# Altium project MSM8916_DRAM_PMIC_REF.PrjPcb (part 4 of 4)

## Sheet SD Card_WCN_RF.SchDoc
size A0
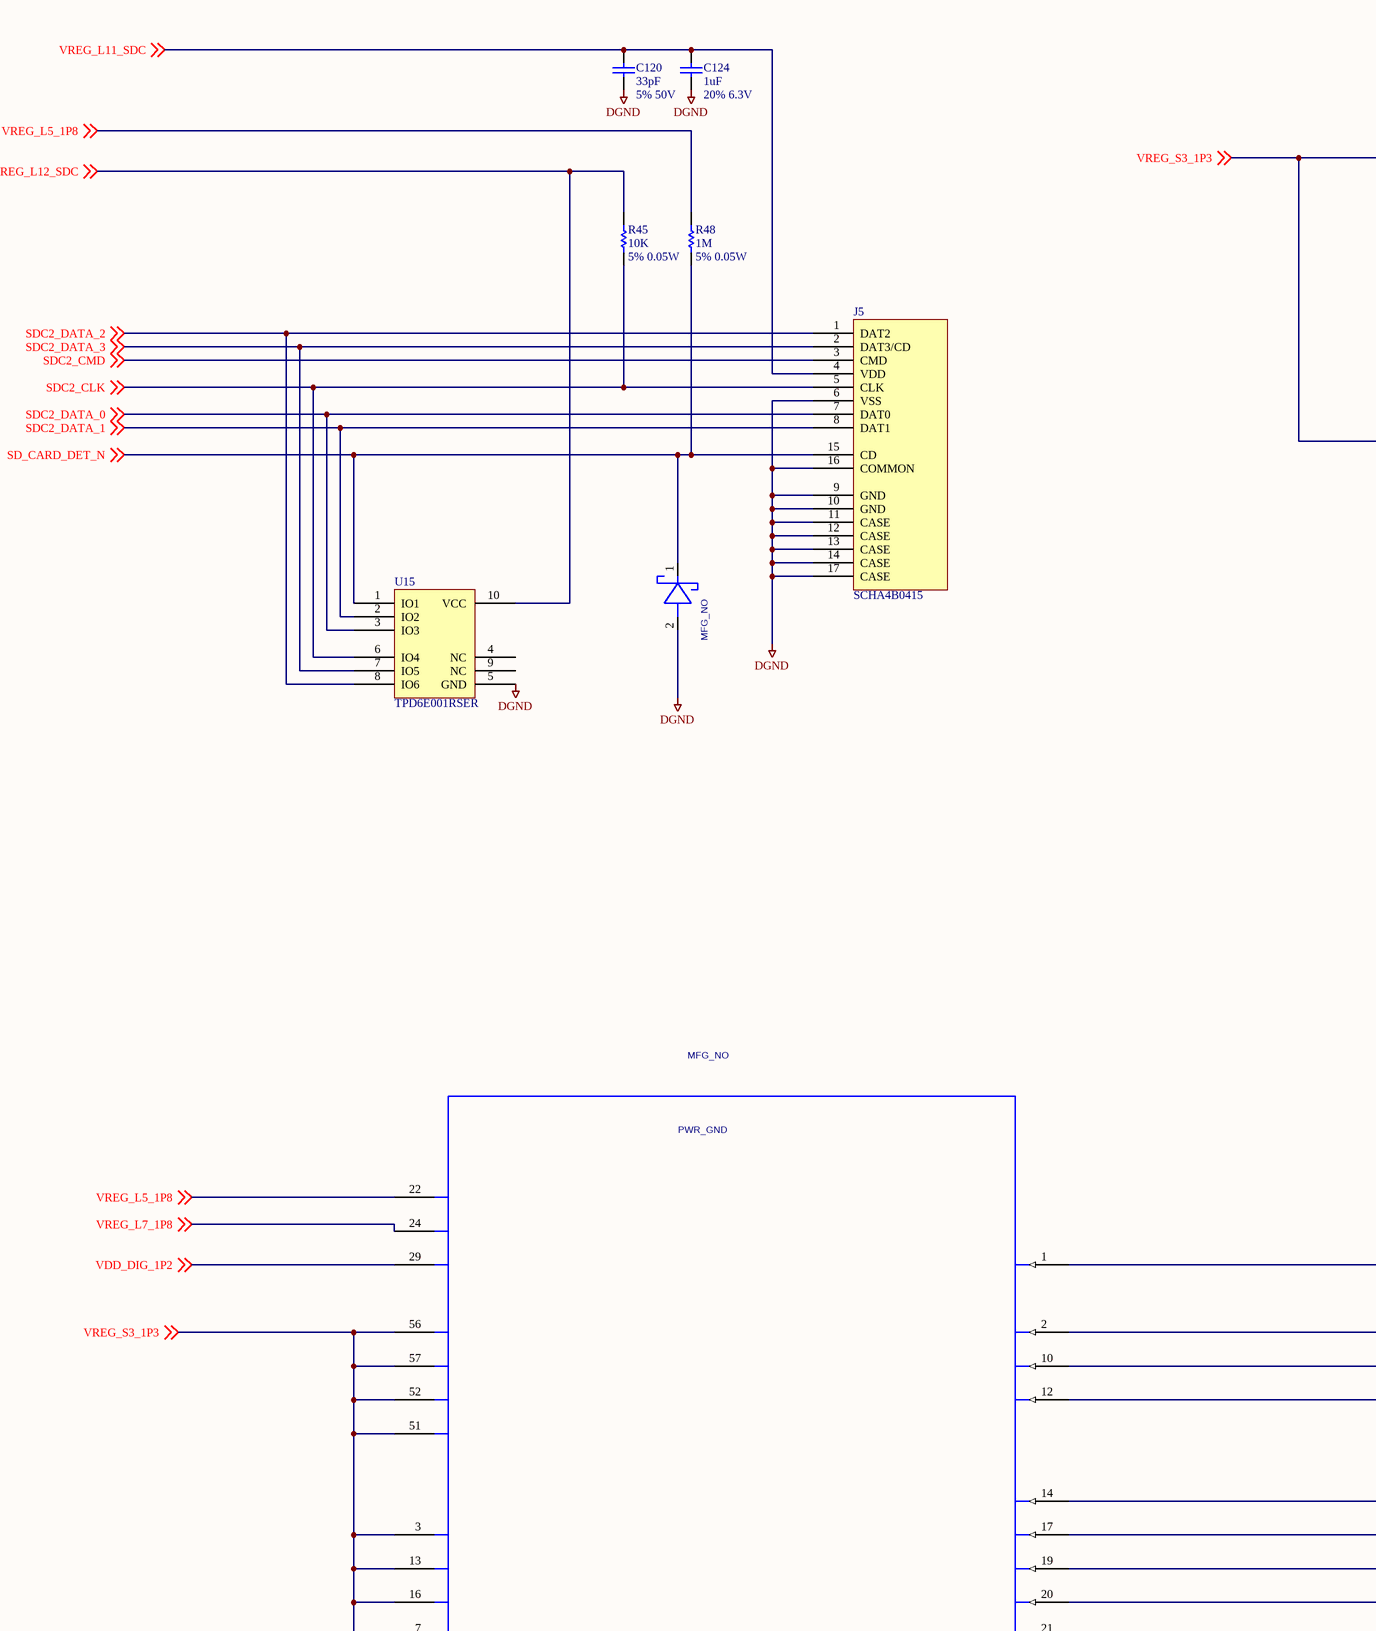
[diagram p60: SD Card_WCN_RF.SchDoc, top left]
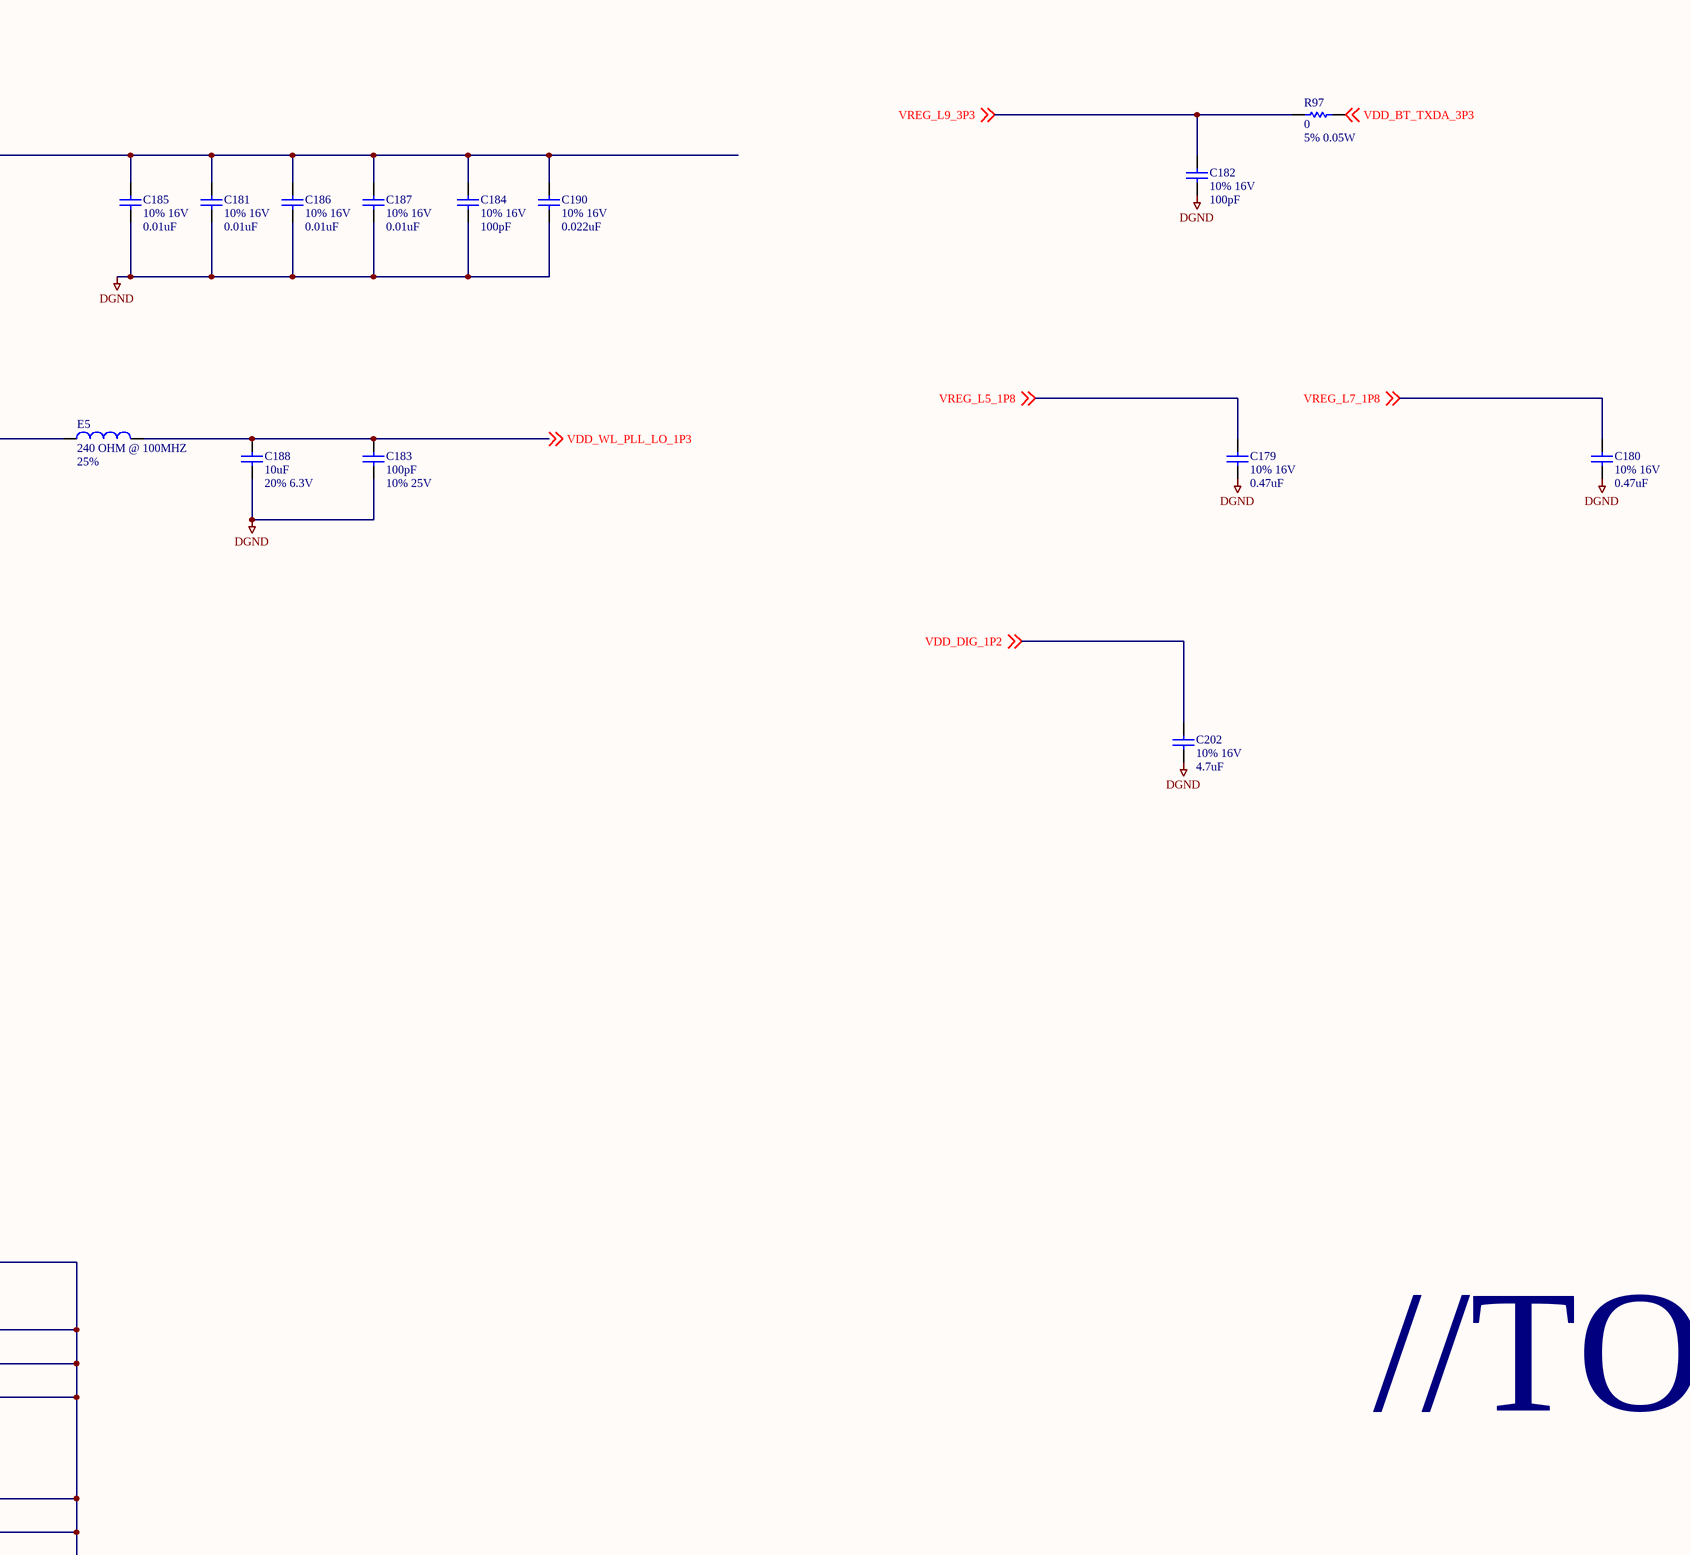
[diagram p61: SD Card_WCN_RF.SchDoc, top middle]
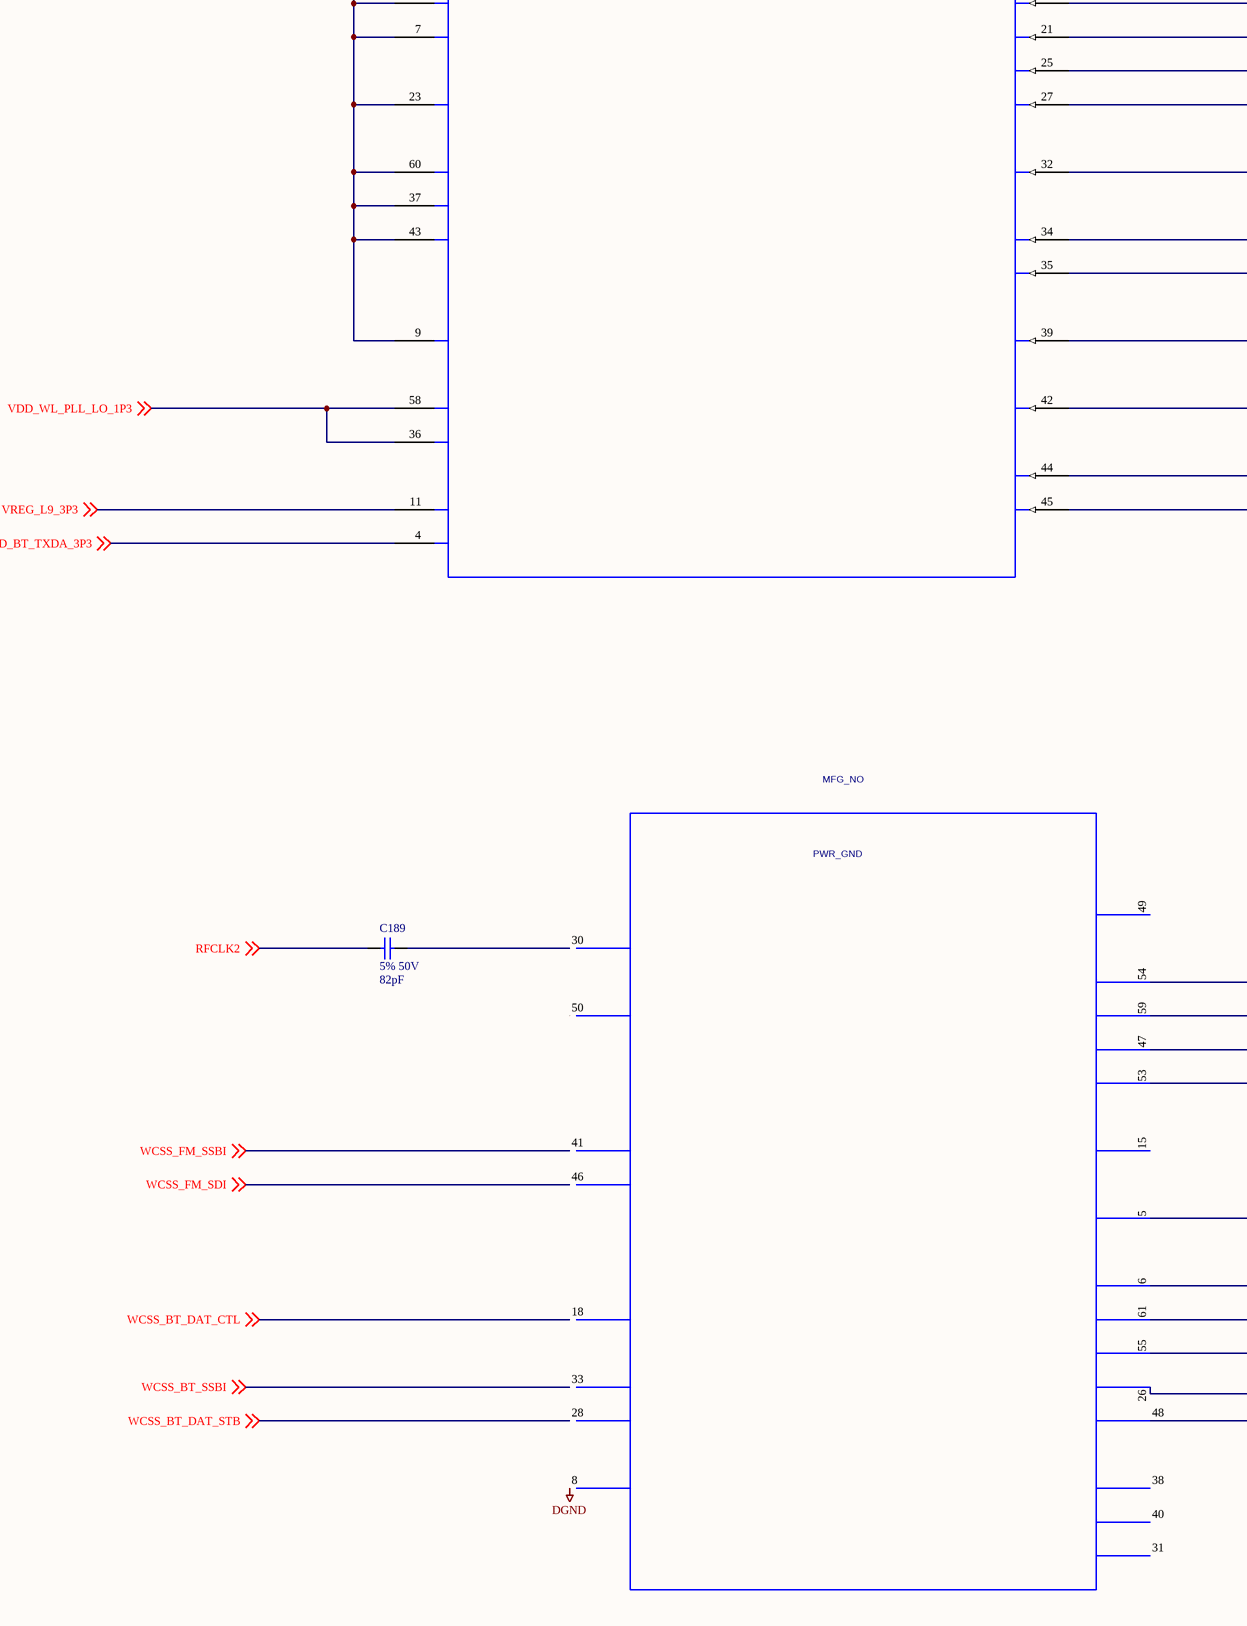
[diagram p62: SD Card_WCN_RF.SchDoc, bottom left]
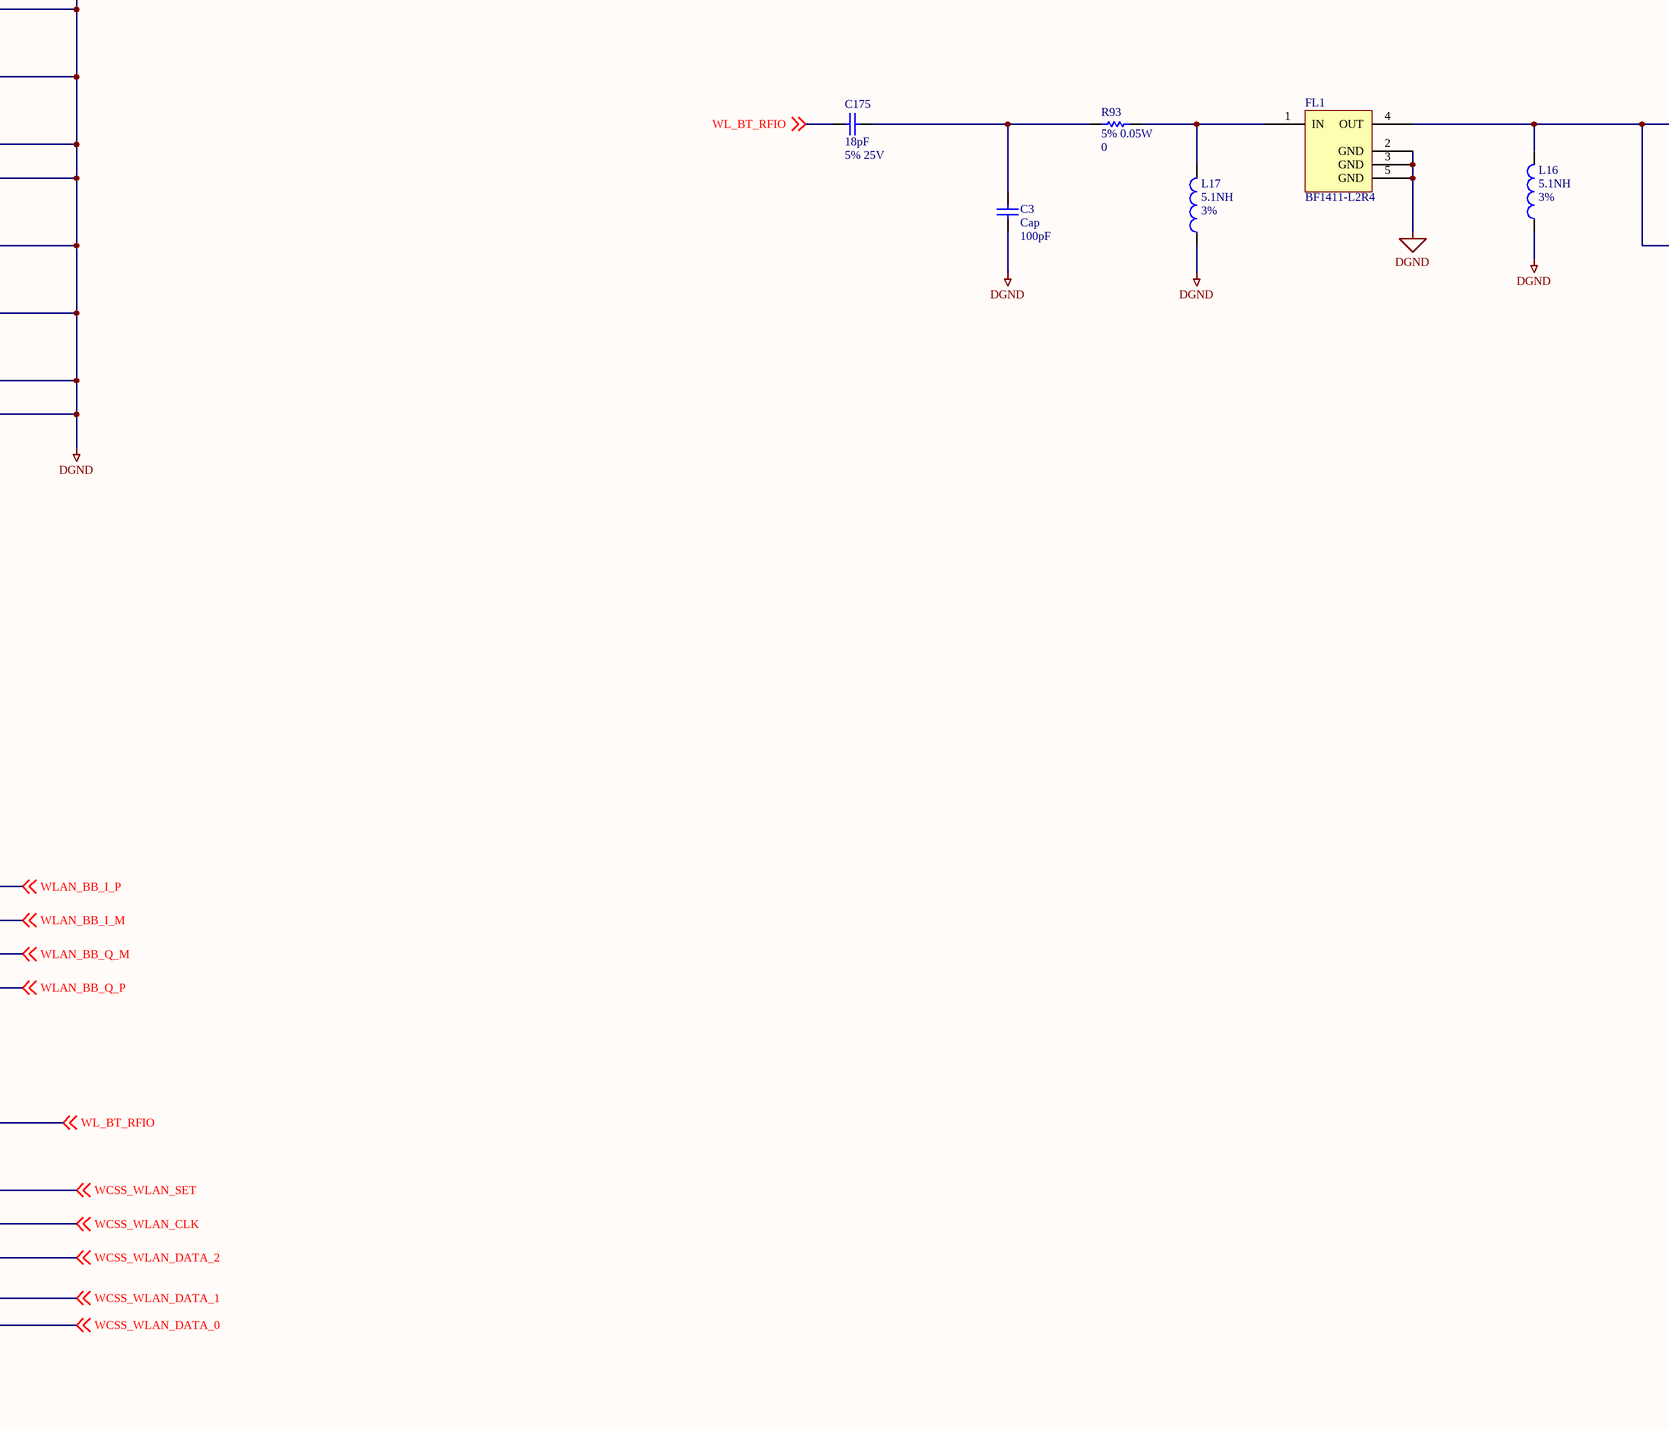
[diagram p63: SD Card_WCN_RF.SchDoc, bottom middle]
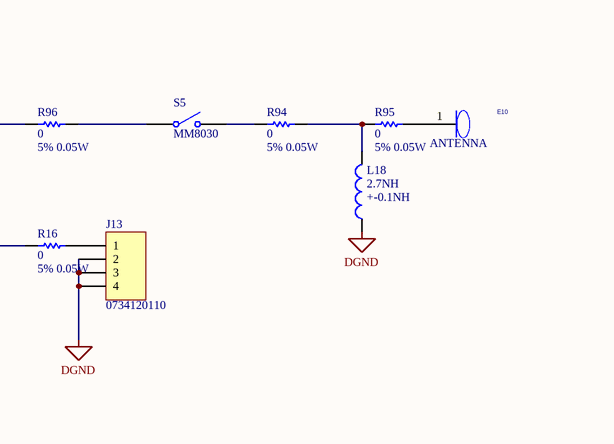
[diagram p64: SD Card_WCN_RF.SchDoc, bottom right]

### Parts
C3  Cap  value 100pF  [RAD-0.3]
C120  33pF  value 5% 50V  [C0402]
C124  1uF  value 20% 6.3V  [C0402]
C175  18pF  value 5% 25V  [RAD-0.3]
C179  10% 16V  value 0.47uF  [C0402]
C180  10% 16V  value 0.47uF  [C0402]
C181  10% 16V  value 0.01uF  [C0402]
C182  10% 16V  value 100pF  [C0402]
C183  100pF  value 10% 25V  [C0402]
C184  10% 16V  value 100pF  [C0402]
C185  10% 16V  value 0.01uF  [C0402]
C186  10% 16V  value 0.01uF  [C0402]
C187  10% 16V  value 0.01uF  [C0402]
C188  10uF  value 20% 6.3V  [C0402]
C189  5% 50V  value 82pF  [C0402]
C190  10% 16V  value 0.022uF  [C0402]
C202  10% 16V  value 4.7uF  [C0402]
CR24  PART_ID: MFG_NO  [c0402]  (hidden comment: ESD7C5)
E5  240 OHM @ 100MHZ  value 25%  [0402-A]
E10  ANTENNA  [TP]
FL1  BF1411-L2R4
J5  SCHA4B0415  [c0402]
J13  0734120110  [HDR1X4]
L16  5.1NH  value 3%  [0402-A]
L17  5.1NH  value 3%  [0402-A]
L18  2.7NH  value +-0.1NH  [0402-A]
R16  0  value 5% 0.05W  [AXIAL-0.3]
R45  10K  value 5% 0.05W  [r0402]
R48  1M  value 5% 0.05W  [r0402]
R93  5% 0.05W  value 0  [AXIAL-0.3]
R94  0  value 5% 0.05W  [AXIAL-0.3]
R95  0  value 5% 0.05W  [AXIAL-0.3]
R96  0  value 5% 0.05W  [AXIAL-0.3]
R97  0  value 5% 0.05W  [r0402]
S5  MM8030  [SPST-2]
U9  SYMNAME: PWR_GND  PART_ID: MFG_NO  [WCN-3620-0-61WLNSP-TR-05-0]  (hidden comment: ASIC_WCN3620_80_WL006_1)  (parts A,B of 2)
U15  TPD6E001RSER  [c0402]

### Nets
DGND: C3.1 C120.1 C124.1 C179.1 C180.1 C181.1 C182.1 C183.1 C184.1 C185.1 C186.1 C187.1 C188.1 C190.1 C202.1 CR24.2(POS) FL1.2(GND) FL1.3(GND) FL1.5(GND) J5.6(VSS) J5.9(GND) J5.10(GND) J5.11(CASE) J5.12(CASE) J5.13(CASE) J5.14(CASE) J5.16(COMMON) J5.17(CASE) J13.2 J13.3 J13.4 L16.1 L17.1 L18.1 U9.1(GND2) U9.2(GND3) U9.8(GND1) U9.10(GND4) U9.12(GND5) U9.14(GND6) U9.17(GND7) U9.19(GND8) U9.20(GND9) U9.21(GND10) U9.25(GND11) U9.27(GND12) U9.32(GND13) U9.34(GND14) U9.35(GND15) U9.39(GND16) U9.42(GND17) U9.44(GND18) U9.45(GND19) U15.5(GND)
VREG_L5_1P8: C179.2 R48.2 U9.22(VDD_IO_1P8) ; off-sheet VREG_L5_1P8
RFCLK2: C189.2 ; off-sheet RFCLK2
SD_CARD_DET_N: CR24.1(NEG) J5.15(CD) R48.1 U15.1(IO1) ; off-sheet SD_CARD_DET_N
SDC2_CLK: J5.5(CLK) R45.1 U15.6(IO4) ; off-sheet SDC2_CLK
SDC2_CMD: J5.3(CMD) ; off-sheet SDC2_CMD
SDC2_DATA_0: J5.7(DAT0) U15.3(IO3) ; off-sheet SDC2_DATA_0
SDC2_DATA_1: J5.8(DAT1) U15.2(IO2) ; off-sheet SDC2_DATA_1
SDC2_DATA_2: J5.1(DAT2) U15.8(IO6) ; off-sheet SDC2_DATA_2
SDC2_DATA_3: J5.2(DAT3/CD) U15.7(IO5) ; off-sheet SDC2_DATA_3
VDD_BT_TXDA_3P3: R97.2 U9.4(VDD_BT_DA_3P0) ; off-sheet VDD_BT_TXDA_3P3
VDD_DIG_1P2: C202.2 U9.29(VDD_DIG_1P2) ; off-sheet VDD_DIG_1P2
VDD_WL_PLL_LO_1P3: C183.2 C188.2 E5.2 U9.36(VDD_WL_LO_1P3) U9.58(VDD_WL_PLL_1P3) ; off-sheet VDD_WL_PLL_LO_1P3
VREG_L7_1P8: C180.2 U9.24(VDD_XO_1P8) ; off-sheet VREG_L7_1P8
VREG_L9_3P3: C182.2 R97.1 U9.11(VDD_WL_2GPA_3P0) ; off-sheet VREG_L9_3P3
VREG_L11_SDC: C120.2 C124.2 J5.4(VDD) ; off-sheet VREG_L11_SDC
VREG_L12_SDC: R45.2 U15.10(VCC) ; off-sheet VREG_L12_SDC
VREG_S3_1P3: C181.2 C184.2 C185.2 C186.2 C187.2 C190.2 E5.1 U9.3(VDD_BT_RF_1P3) U9.7(VDD_BT_VCO_1P3) U9.9(VDD_WL_2GLNA_1P3) U9.13(VDD_BT_BB_1P3) U9.16(VDD_BT_PLL_1P3) U9.23(VDD_BT_FM_DIG_1P3) U9.37(VDD_WL_2GPA_1P3) U9.43(VDD_WL_UPC_1P3) U9.51(VDD_FM_VCO_1P3) U9.52(VDD_FM_PLL_1P3) U9.56(VDD_FM_RXFE_1P3) U9.57(VDD_FM_RXBB_1P3) U9.60(VDD_WL_BB_1P3) ; off-sheet VREG_S3_1P3  [project net VREG_S3]
WCSS_BT_DAT_CTL: U9.18(BT_CTL) ; off-sheet WCSS_BT_DAT_CTL
WCSS_BT_DAT_STB: U9.28(BT_DATA) ; off-sheet WCSS_BT_DAT_STB
WCSS_BT_SSBI: U9.33(BT_SSBI) ; off-sheet WCSS_BT_SSBI
WCSS_FM_SDI: U9.46(FM_DATA) ; off-sheet WCSS_FM_SDI
WCSS_FM_SSBI: U9.41(FM_SSBI) ; off-sheet WCSS_FM_SSBI
WCSS_WLAN_CLK: U9.61(WL_CMD_CLK) ; off-sheet WCSS_WLAN_CLK
WCSS_WLAN_DATA_0: U9.48(WL_CMD_DATA0) ; off-sheet WCSS_WLAN_DATA_0
WCSS_WLAN_DATA_1: U9.26(WL_CMD_DATA1) ; off-sheet WCSS_WLAN_DATA_1
WCSS_WLAN_DATA_2: U9.55(WL_CMD_DATA2) ; off-sheet WCSS_WLAN_DATA_2
WCSS_WLAN_SET: U9.6(WL_CMD_SET) ; off-sheet WCSS_WLAN_SET
WL_BT_RFIO: C175.1 U9.5(WL_BT_RFIO) ; off-sheet WL_BT_RFIO
WLAN_BB_I_M: U9.59(WL_BB_IN) ; off-sheet WLAN_BB_I_M
WLAN_BB_I_P: U9.54(WL_BB_IP) ; off-sheet WLAN_BB_I_P
WLAN_BB_Q_M: U9.47(WL_BB_QN) ; off-sheet WLAN_BB_Q_M
WLAN_BB_Q_P: U9.53(WL_BB_QP) ; off-sheet WLAN_BB_Q_P
NetC3_2: C3.2 C175.2 R93.1
NetC189_1: C189.1 U9.30(TCXO_IN)
NetE10_1: E10.1 R95.2
NetFL1_1: FL1.1(IN) L17.2 R93.2
NetFL1_4: FL1.4(OUT) L16.2 R16.1 R96.1
NetJ13_1: J13.1 R16.2
NetL18_2: L18.2 R94.2 R95.1
NetR94_1: R94.1 S5.2(NO)
NetR96_2: R96.2 S5.1(COMMON)

Not connected (* = marked no-connect by the designer): U9 15(NC1) 31(NC2) 38(NC4) 40(NC3) 49(WL_PDET_IN) 50(FM_HS_RX); U15 4(NC) 9(NC)

### Notes on the sheet
- //TODO ANTENNA HERE

### Library data of the parts
C3 C120 C124 C175 C179-C190 C202 = Cap: Capacitor; Published: 8-Jun-2000; LatestRevisionDate: 17-Jul-2002; LatestRevisionNote: Re-released for DXP Platform.; PackageReference: RAD-0.3; Publisher: Altium Limited; PackageDescription: Radial Cap, Thru-Hole; 2 Leads; 0.3 in Pin Spacing
CR24 = SCHOTTKY: PART_NUMBER: MCN_NO; OriginalSymbolOrigin: (-100,100); CDS_LMAN_SYM_OUTLINE: -50,75,50,-75; SYMNAME: SCHOTTKY; PACK_TYPE: ?
E5 L16-L18 = Inductor: Code_IEC: 1005; Published: 8-Jun-2000; LatestRevisionDate: 29-May-2009; LatestRevisionNote: IPC-7351 Footprint Added.; PackageReference: 0402-A; Publisher: Altium Limited; PackageDescription: Chip Inductor; Code_JEITA: 0402
E10 = TP
J13 = Header 4: Header, 4-Pin; LatestRevisionDate: 17-Jul-2002; LatestRevisionNote: Re-released for DXP Platform.; Publisher: Altium Limited
R16 R45 R48 R93-R97 = Res1: Resistor; Published: 8-Jun-2000; LatestRevisionDate: 17-Jul-2002; LatestRevisionNote: Re-released for DXP Platform.; PackageReference: AXIAL-0.3; Publisher: Altium Limited; PackageDescription: Axial Device, Thru-Hole; 2 Leads; 0.3 in Pin Spacing
S5 = SW-SPST: Single-Pole, Single-Throw Switch; Published: 24-Mar-1999; LatestRevisionDate: 17-Jul-2002; LatestRevisionNote: Re-released for DXP Platform.; PackageReference: SPST-2; Publisher: Altium Limited; PackageDescription: Switch; 2 Leads
U9 = ASIC_WCN3620_80_WL006_1: PART_NUMBER: MCN_NO; OriginalSymbolOrigin: (-1075,1375); SPLIT_INST: TRUE; CDS_LMAN_SYM_OUTLINE: -850,1375,875,-1500; CDS_LMAN_SPLIT_NUMBER: 1 of 2; PACK_TYPE: ?

## Sheet INTERFACE_PWR_LS_HS.SchDoc
size A4
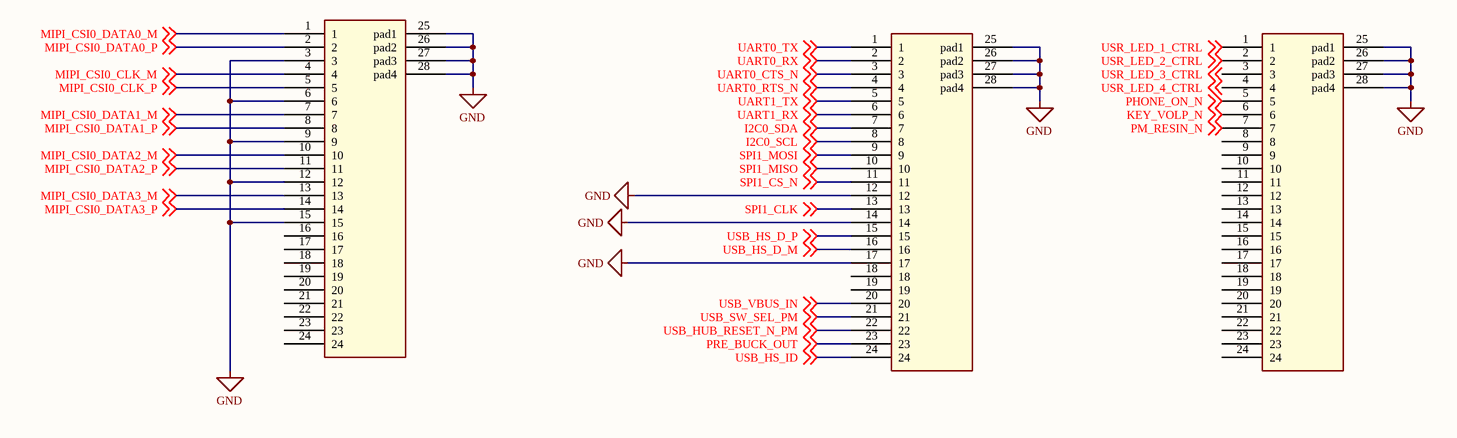
[diagram p65: INTERFACE_PWR_LS_HS.SchDoc]

### Parts
CN0  CON24_0  [c0402]  (value not drawn)
CN1  CON24_0  [c0402]  (value not drawn)
CN2  CON24_0  [c0402]  (value not drawn)

### Nets
GND: CN0.3 CN0.6 CN0.9 CN0.12 CN0.15 CN0.25(pad1) CN0.26(pad2) CN0.27(pad3) CN0.28(pad4) CN1.12 CN1.14 CN1.17 CN1.25(pad1) CN1.26(pad2) CN1.27(pad3) CN1.28(pad4) CN2.25(pad1) CN2.26(pad2) CN2.27(pad3) CN2.28(pad4)
I2C0_SCL: CN1.8 ; off-sheet I2C0_SCL
I2C0_SDA: CN1.7 ; off-sheet I2C0_SDA
KEY_VOLP_N: CN2.6 ; off-sheet KEY_VOLP_N
MIPI_CSI0_CLK_M: CN0.4 ; off-sheet MIPI_CSI0_CLK_M
MIPI_CSI0_CLK_P: CN0.5 ; off-sheet MIPI_CSI0_CLK_P
MIPI_CSI0_DATA0_M: CN0.1 ; off-sheet MIPI_CSI0_DATA0_M
MIPI_CSI0_DATA0_P: CN0.2 ; off-sheet MIPI_CSI0_DATA0_P
MIPI_CSI0_DATA1_M: CN0.7 ; off-sheet MIPI_CSI0_DATA1_M
MIPI_CSI0_DATA1_P: CN0.8 ; off-sheet MIPI_CSI0_DATA1_P
MIPI_CSI0_DATA2_M: CN0.10 ; off-sheet MIPI_CSI0_DATA2_M
MIPI_CSI0_DATA2_P: CN0.11 ; off-sheet MIPI_CSI0_DATA2_P
MIPI_CSI0_DATA3_M: CN0.13 ; off-sheet MIPI_CSI0_DATA3_M
MIPI_CSI0_DATA3_P: CN0.14 ; off-sheet MIPI_CSI0_DATA3_P
PHONE_ON_N: CN2.5 ; off-sheet PHONE_ON_N
PM_RESIN_N: CN2.7 ; off-sheet PM_RESIN_N
PRE_BUCK_OUT: CN1.23 ; off-sheet PRE_BUCK_OUT
SPI1_CLK: CN1.13 ; off-sheet SPI1_CLK
SPI1_CS_N: CN1.11 ; off-sheet SPI1_CS_N
SPI1_MISO: CN1.10 ; off-sheet SPI1_MISO
SPI1_MOSI: CN1.9 ; off-sheet SPI1_MOSI
UART0_CTS_N: CN1.3 ; off-sheet UART0_CTS_N
UART0_RTS_N: CN1.4 ; off-sheet UART0_RTS_N
UART0_RX: CN1.2 ; off-sheet UART0_RX
UART0_TX: CN1.1 ; off-sheet UART0_TX
UART1_RX: CN1.6 ; off-sheet UART1_RX
UART1_TX: CN1.5 ; off-sheet UART1_TX
USB_HS_D_M: CN1.16 ; off-sheet USB_HS_D_M
USB_HS_D_P: CN1.15 ; off-sheet USB_HS_D_P
USB_HS_ID: CN1.24 ; off-sheet USB_HS_ID
USB_HUB_RESET_N_PM: CN1.22 ; off-sheet USB_HUB_RESET_N_PM
USB_SW_SEL_PM: CN1.21 ; off-sheet USB_SW_SEL_PM
USB_VBUS_IN: CN1.20 ; off-sheet USB_VBUS_IN
USR_LED_1_CTRL: CN2.1 ; off-sheet USR_LED_1_CTRL
USR_LED_2_CTRL: CN2.2 ; off-sheet USR_LED_2_CTRL
USR_LED_3_CTRL: CN2.3 ; off-sheet USR_LED_3_CTRL
USR_LED_4_CTRL: CN2.4 ; off-sheet USR_LED_4_CTRL

Not connected (* = marked no-connect by the designer): CN0 16 17 18 19 20 21 22 23 24; CN1 18 19; CN2 8 9 10 11 12 13 14 15 16 17 18 19 20 21 22 23 24

## Nets that join several sheets
DGND: 06_MSM8916_EBIO LPDDR3 (R5.2), 05 MSM8916_CONTROL (5 pins), 08_MSM8916_RF (31 pins), 11 MSM8916_POWER2 (C5.1), 10 MSM8916_POWER1 (C4.1), 12 MSM8916_POWER3 (16 pins), 14 PM8916_CONTROL CLOCK (14 pins), 15 PM8916_CHARGING GPIO (26 pins), 16 PM8916_SMPS (20 pins), 17 PM8916_LDO (19 pins), 20 MEMORY_CONTROL (R43.1 R163.1), BYPASS_CAP (44 pins), SD Card_WCN_RF (54 pins)
GND: 06_MSM8916_EBIO LPDDR3 (R4.2 R5.1 R8.2), 21 MEMORY_POWER (87 pins), 14 PM8916_CONTROL CLOCK (R134.1 R135.1), INTERFACE_PWR_LS_HS (20 pins)
VREG_L2_1P2: 11 MSM8916_POWER2 (10 pins), 12 MSM8916_POWER3 (6 pins), 17 PM8916_LDO (C92.2 U3.M1), BYPASS_CAP (C29.2 C36.2 C41.2 C56.2)
VREG_L5_1P8: 07_MSM8916_GPIO (8 pins), 11 MSM8916_POWER2 (18 pins), 17 PM8916_LDO (C146.2 U3.P10), 20 MEMORY_CONTROL (R44.2), BYPASS_CAP (8 pins), SD Card_WCN_RF (C179.2 R48.2 U9.22)
VREG_L6_1P8: 10 MSM8916_POWER1 (U1.AJ8), 12 MSM8916_POWER3 (C14.2 U1.AH5), 14 PM8916_CONTROL CLOCK (C66.1 R28.1), 17 PM8916_LDO (C147.2 U3.M8)
APQ_BBCLK1_EN: 05 MSM8916_CONTROL (U1.A36), 14 PM8916_CONTROL CLOCK (U3.E4)
APQ_PS_HOLD: 05 MSM8916_CONTROL (U1.E36), 14 PM8916_CONTROL CLOCK (R25.1)
APQ_RESIN_N: 05 MSM8916_CONTROL (U1.F35), 14 PM8916_CONTROL CLOCK (R166.1)
APQ_RESOUT_N: 05 MSM8916_CONTROL (U1.AV1), 20 MEMORY_CONTROL (U2.C2)
BBCLK1: 05 MSM8916_CONTROL (U1.AD35 U1.AL34), 14 PM8916_CONTROL CLOCK (U3.F2)
EBI_CA0: 06_MSM8916_EBIO LPDDR3 (U1.E10), 20 MEMORY_CONTROL (U2.Y2)
EBI_CA1: 06_MSM8916_EBIO LPDDR3 (U1.E8), 20 MEMORY_CONTROL (U2.Y3)
EBI_CA2: 06_MSM8916_EBIO LPDDR3 (U1.C6), 20 MEMORY_CONTROL (U2.W2)
EBI_CA3: 06_MSM8916_EBIO LPDDR3 (U1.D9), 20 MEMORY_CONTROL (U2.W3)
EBI_CA4: 06_MSM8916_EBIO LPDDR3 (U1.E6), 20 MEMORY_CONTROL (U2.V3)
EBI_CA5: 06_MSM8916_EBIO LPDDR3 (U1.B13), 20 MEMORY_CONTROL (U2.L3)
EBI_CA6: 06_MSM8916_EBIO LPDDR3 (U1.C12), 20 MEMORY_CONTROL (U2.K3)
EBI_CA7: 06_MSM8916_EBIO LPDDR3 (U1.D13), 20 MEMORY_CONTROL (U2.J3)
EBI_CA8: 06_MSM8916_EBIO LPDDR3 (U1.B11), 20 MEMORY_CONTROL (U2.J2)
EBI_CA9: 06_MSM8916_EBIO LPDDR3 (U1.E14), 20 MEMORY_CONTROL (U2.H2)
EBI_CK: 06_MSM8916_EBIO LPDDR3 (U1.C10), 20 MEMORY_CONTROL (U2.P3)
EBI_CKB: 06_MSM8916_EBIO LPDDR3 (U1.D11), 20 MEMORY_CONTROL (U2.N3)
EBI_CKE_0: 06_MSM8916_EBIO LPDDR3 (U1.A8), 20 MEMORY_CONTROL (U2.T2)
EBI_CKE_1: 06_MSM8916_EBIO LPDDR3 (U1.A10), 20 MEMORY_CONTROL (U2.R2)
EBI_CS0_N: 06_MSM8916_EBIO LPDDR3 (U1.B7), 20 MEMORY_CONTROL (U2.U3)
EBI_CS1_N: 06_MSM8916_EBIO LPDDR3 (U1.B9), 20 MEMORY_CONTROL (U2.T3)
EBI_DM0: 06_MSM8916_EBIO LPDDR3 (U1.F23), 20 MEMORY_CONTROL (U2.R10)
EBI_DM1: 06_MSM8916_EBIO LPDDR3 (U1.E24), 20 MEMORY_CONTROL (U2.N10)
EBI_DM2: 06_MSM8916_EBIO LPDDR3 (U1.B19), 20 MEMORY_CONTROL (U2.W10)
EBI_DM3: 06_MSM8916_EBIO LPDDR3 (U1.B31), 20 MEMORY_CONTROL (U2.J10)
EBI_DQ0: 06_MSM8916_EBIO LPDDR3 (U1.E20), 20 MEMORY_CONTROL (U2.W12)
EBI_DQ1: 06_MSM8916_EBIO LPDDR3 (U1.E22), 20 MEMORY_CONTROL (U2.V11)
EBI_DQ2: 06_MSM8916_EBIO LPDDR3 (U1.A20), 20 MEMORY_CONTROL (U2.V13)
EBI_DQ3: 06_MSM8916_EBIO LPDDR3 (U1.D21), 20 MEMORY_CONTROL (U2.U11)
EBI_DQ4: 06_MSM8916_EBIO LPDDR3 (U1.B21), 20 MEMORY_CONTROL (U2.U13)
EBI_DQ5: 06_MSM8916_EBIO LPDDR3 (U1.D23), 20 MEMORY_CONTROL (U2.T11)
EBI_DQ6: 06_MSM8916_EBIO LPDDR3 (U1.B23), 20 MEMORY_CONTROL (U2.T13)
EBI_DQ7: 06_MSM8916_EBIO LPDDR3 (U1.A24), 20 MEMORY_CONTROL (U2.R12)
EBI_DQ8: 06_MSM8916_EBIO LPDDR3 (U1.E28), 20 MEMORY_CONTROL (U2.N12)
EBI_DQ9: 06_MSM8916_EBIO LPDDR3 (U1.C26), 20 MEMORY_CONTROL (U2.M13)
EBI_DQ10: 06_MSM8916_EBIO LPDDR3 (U1.A26), 20 MEMORY_CONTROL (U2.M11)
EBI_DQ11: 06_MSM8916_EBIO LPDDR3 (U1.B29), 20 MEMORY_CONTROL (U2.L13)
EBI_DQ12: 06_MSM8916_EBIO LPDDR3 (U1.D29), 20 MEMORY_CONTROL (U2.L11)
EBI_DQ13: 06_MSM8916_EBIO LPDDR3 (U1.C28), 20 MEMORY_CONTROL (U2.K11)
EBI_DQ14: 06_MSM8916_EBIO LPDDR3 (U1.A30), 20 MEMORY_CONTROL (U2.K13)
EBI_DQ15: 06_MSM8916_EBIO LPDDR3 (U1.E30), 20 MEMORY_CONTROL (U2.J12)
EBI_DQ16: 06_MSM8916_EBIO LPDDR3 (U1.B17), 20 MEMORY_CONTROL (U2.AB12)
EBI_DQ17: 06_MSM8916_EBIO LPDDR3 (U1.B15), 20 MEMORY_CONTROL (U2.AB11)
EBI_DQ18: 06_MSM8916_EBIO LPDDR3 (U1.A14), 20 MEMORY_CONTROL (U2.AB10)
EBI_DQ19: 06_MSM8916_EBIO LPDDR3 (U1.A18), 20 MEMORY_CONTROL (U2.AA13)
EBI_DQ20: 06_MSM8916_EBIO LPDDR3 (U1.D15), 20 MEMORY_CONTROL (U2.AA12)
EBI_DQ21: 06_MSM8916_EBIO LPDDR3 (U1.C14), 20 MEMORY_CONTROL (U2.AA10)
EBI_DQ22: 06_MSM8916_EBIO LPDDR3 (U1.D17), 20 MEMORY_CONTROL (U2.Y13)
EBI_DQ23: 06_MSM8916_EBIO LPDDR3 (U1.E16), 20 MEMORY_CONTROL (U2.Y11)
EBI_DQ24: 06_MSM8916_EBIO LPDDR3 (U1.C34), 20 MEMORY_CONTROL (U2.H11)
EBI_DQ25: 06_MSM8916_EBIO LPDDR3 (U1.F33), 20 MEMORY_CONTROL (U2.H13)
EBI_DQ26: 06_MSM8916_EBIO LPDDR3 (U1.C36), 20 MEMORY_CONTROL (U2.G10)
EBI_DQ27: 06_MSM8916_EBIO LPDDR3 (U1.D35), 20 MEMORY_CONTROL (U2.G12)
EBI_DQ28: 06_MSM8916_EBIO LPDDR3 (U1.E34), 20 MEMORY_CONTROL (U2.G13)
EBI_DQ29: 06_MSM8916_EBIO LPDDR3 (U1.B35), 20 MEMORY_CONTROL (U2.F10)
EBI_DQ30: 06_MSM8916_EBIO LPDDR3 (U1.A34), 20 MEMORY_CONTROL (U2.F11)
EBI_DQ31: 06_MSM8916_EBIO LPDDR3 (U1.B33), 20 MEMORY_CONTROL (U2.F12)
EBI_DQS0_C: 06_MSM8916_EBIO LPDDR3 (U1.B25), 20 MEMORY_CONTROL (U2.R9)
EBI_DQS0_T: 06_MSM8916_EBIO LPDDR3 (U1.C24), 20 MEMORY_CONTROL (U2.T9)
EBI_DQS1_C: 06_MSM8916_EBIO LPDDR3 (U1.D25), 20 MEMORY_CONTROL (U2.N9)
EBI_DQS1_T: 06_MSM8916_EBIO LPDDR3 (U1.E26), 20 MEMORY_CONTROL (U2.M9)
EBI_DQS2_C: 06_MSM8916_EBIO LPDDR3 (U1.D19), 20 MEMORY_CONTROL (U2.W9)
EBI_DQS2_T: 06_MSM8916_EBIO LPDDR3 (U1.E18), 20 MEMORY_CONTROL (U2.Y9)
EBI_DQS3_C: 06_MSM8916_EBIO LPDDR3 (U1.D31), 20 MEMORY_CONTROL (U2.J9)
EBI_DQS3_T: 06_MSM8916_EBIO LPDDR3 (U1.E32), 20 MEMORY_CONTROL (U2.H9)
EBIO_VREF: 05 MSM8916_CONTROL (C1.1 U1.H21 U1.J12 U1.J26), 21 MEMORY_POWER (C102.1 U2.M2 U2.P13), 14 PM8916_CONTROL CLOCK (C65.1 U3.A2)
I2C0_SCL: 07_MSM8916_GPIO (R9.2 U1.AV3), INTERFACE_PWR_LS_HS (CN1.8)
I2C0_SDA: 07_MSM8916_GPIO (R6.2 U1.AY3), INTERFACE_PWR_LS_HS (CN1.7)
KEY_VOLP_N: 07_MSM8916_GPIO (U1.H33), INTERFACE_PWR_LS_HS (CN2.6)
MIPI_CSI0_CLK_M: 09_MSM8916_MIPI (U1.W6), INTERFACE_PWR_LS_HS (CN0.4)
MIPI_CSI0_CLK_P: 09_MSM8916_MIPI (U1.V5), INTERFACE_PWR_LS_HS (CN0.5)
MIPI_CSI0_DATA0_M: 09_MSM8916_MIPI (U1.U4), INTERFACE_PWR_LS_HS (CN0.1)
MIPI_CSI0_DATA0_P: 09_MSM8916_MIPI (U1.U6), INTERFACE_PWR_LS_HS (CN0.2)
MIPI_CSI0_DATA1_M: 09_MSM8916_MIPI (U1.U2), INTERFACE_PWR_LS_HS (CN0.7)
MIPI_CSI0_DATA1_P: 09_MSM8916_MIPI (U1.T1), INTERFACE_PWR_LS_HS (CN0.8)
MIPI_CSI0_DATA2_M: 09_MSM8916_MIPI (U1.W2), INTERFACE_PWR_LS_HS (CN0.10)
MIPI_CSI0_DATA2_P: 09_MSM8916_MIPI (U1.V1), INTERFACE_PWR_LS_HS (CN0.11)
MIPI_CSI0_DATA3_M: 09_MSM8916_MIPI (U1.AA6), INTERFACE_PWR_LS_HS (CN0.13)
MIPI_CSI0_DATA3_P: 09_MSM8916_MIPI (U1.Y5), INTERFACE_PWR_LS_HS (CN0.14)
PHONE_ON_N: 14 PM8916_CONTROL CLOCK (U3.K10), INTERFACE_PWR_LS_HS (CN2.5)
PM_RESIN_N: 14 PM8916_CONTROL CLOCK (U3.C3), INTERFACE_PWR_LS_HS (CN2.7)
PRE_BUCK_OUT: 15 PM8916_CHARGING GPIO (R88.1), INTERFACE_PWR_LS_HS (CN1.23)
RFCLK2: 14 PM8916_CONTROL CLOCK (U3.L2), SD Card_WCN_RF (C189.2)
SD_CARD_DET_N: 07_MSM8916_GPIO (U1.B37), SD Card_WCN_RF (CR24.1 J5.15 R48.1 U15.1)
SDC1_CLK: 05 MSM8916_CONTROL (R2.2), 20 MEMORY_CONTROL (U2.B8)
SDC1_CMD: 05 MSM8916_CONTROL (U1.AH35), 20 MEMORY_CONTROL (R44.1 U2.A6)
SDC1_DATA_0: 05 MSM8916_CONTROL (U1.AD37), 20 MEMORY_CONTROL (U2.A9)
SDC1_DATA_1: 05 MSM8916_CONTROL (U1.AE38), 20 MEMORY_CONTROL (U2.B10)
SDC1_DATA_2: 05 MSM8916_CONTROL (U1.AG34), 20 MEMORY_CONTROL (U2.C6)
SDC1_DATA_3: 05 MSM8916_CONTROL (U1.AH37), 20 MEMORY_CONTROL (U2.B5)
SDC1_DATA_4: 05 MSM8916_CONTROL (U1.AG40), 20 MEMORY_CONTROL (U2.C9)
SDC1_DATA_5: 05 MSM8916_CONTROL (U1.AG38), 20 MEMORY_CONTROL (U2.A10)
SDC1_DATA_6: 05 MSM8916_CONTROL (U1.AF39), 20 MEMORY_CONTROL (U2.A5)
SDC1_DATA_7: 05 MSM8916_CONTROL (U1.AF35), 20 MEMORY_CONTROL (U2.B4)
SDC2_CLK: 05 MSM8916_CONTROL (R3.2), SD Card_WCN_RF (J5.5 R45.1 U15.6)
SDC2_CMD: 05 MSM8916_CONTROL (U1.N6), SD Card_WCN_RF (J5.3)
SDC2_DATA_0: 05 MSM8916_CONTROL (U1.P3), SD Card_WCN_RF (J5.7 U15.3)
SDC2_DATA_1: 05 MSM8916_CONTROL (U1.R6), SD Card_WCN_RF (J5.8 U15.2)
SDC2_DATA_2: 05 MSM8916_CONTROL (U1.T7), SD Card_WCN_RF (J5.1 U15.8)
SDC2_DATA_3: 05 MSM8916_CONTROL (U1.P7), SD Card_WCN_RF (J5.2 U15.7)
SLEEP_CLK: 05 MSM8916_CONTROL (U1.G36), 14 PM8916_CONTROL CLOCK (U3.G6)
SPI1_CLK: 07_MSM8916_GPIO (U1.E2), INTERFACE_PWR_LS_HS (CN1.13)
SPI1_CS_N: 07_MSM8916_GPIO (U1.H1), INTERFACE_PWR_LS_HS (CN1.11)
SPI1_MISO: 07_MSM8916_GPIO (U1.G2), INTERFACE_PWR_LS_HS (CN1.10)
SPI1_MOSI: 07_MSM8916_GPIO (U1.H5), INTERFACE_PWR_LS_HS (CN1.9)
SPMI_CLK: 05 MSM8916_CONTROL (C173.1 U1.AK37), 14 PM8916_CONTROL CLOCK (U3.A10)
SPMI_DATA: 05 MSM8916_CONTROL (C2.1 U1.AJ36), 14 PM8916_CONTROL CLOCK (U3.B10)
UART0_CTS_N: 07_MSM8916_GPIO (U1.AV35), INTERFACE_PWR_LS_HS (CN1.3)
UART0_RTS_N: 07_MSM8916_GPIO (U1.AY37), INTERFACE_PWR_LS_HS (CN1.4)
UART0_RX: 07_MSM8916_GPIO (U1.BB39), INTERFACE_PWR_LS_HS (CN1.2)
UART0_TX: 07_MSM8916_GPIO (U1.BA38), INTERFACE_PWR_LS_HS (CN1.1)
UART1_RX: 07_MSM8916_GPIO (U1.AY1), INTERFACE_PWR_LS_HS (CN1.6)
UART1_TX: 07_MSM8916_GPIO (U1.AT9), INTERFACE_PWR_LS_HS (CN1.5)
USB_HS_D_M: 05 MSM8916_CONTROL (U1.AC40), INTERFACE_PWR_LS_HS (CN1.16)
USB_HS_D_P: 05 MSM8916_CONTROL (U1.AB39), INTERFACE_PWR_LS_HS (CN1.15)
USB_HS_ID: 07_MSM8916_GPIO (R158.2), INTERFACE_PWR_LS_HS (CN1.24)
USB_HUB_RESET_N_PM: 15 PM8916_CHARGING GPIO (U3.N11), INTERFACE_PWR_LS_HS (CN1.22)
USB_SW_SEL_PM: 15 PM8916_CHARGING GPIO (U3.L8), INTERFACE_PWR_LS_HS (CN1.21)
USB_VBUS_IN: 15 PM8916_CHARGING GPIO (C197.2 R105.2 U3.N13 U3.P13), INTERFACE_PWR_LS_HS (CN1.20)
USR_LED_1_CTRL: 07_MSM8916_GPIO (U1.AW6), INTERFACE_PWR_LS_HS (CN2.1)
USR_LED_2_CTRL: 07_MSM8916_GPIO (U1.F39), INTERFACE_PWR_LS_HS (CN2.2)
USR_LED_3_CTRL: 15 PM8916_CHARGING GPIO (U3.J7), INTERFACE_PWR_LS_HS (CN2.3)
USR_LED_4_CTRL: 15 PM8916_CHARGING GPIO (U3.H6), INTERFACE_PWR_LS_HS (CN2.4)
VBATT_CONN: 15 PM8916_CHARGING GPIO (R130.1 R138.1), 16 PM8916_SMPS (18 pins), 17 PM8916_LDO (U3.B1 U3.B2 U3.E1 U3.E2)
VDD_PX_BIAS: 10 MSM8916_POWER1 (C4.2 U1.V9 U1.Y33), 15 PM8916_CHARGING GPIO (C70.2 U3.L4)
VFB_S1: 16 PM8916_SMPS (U3.E5), BYPASS_CAP (JP1.1)
VREG_L3_1P15: 10 MSM8916_POWER1 (24 pins), 12 MSM8916_POWER3 (11 pins), 17 PM8916_LDO (C94.2 U3.P1), BYPASS_CAP (9 pins)
VREG_L7_1P8: 12 MSM8916_POWER3 (11 pins), 17 PM8916_LDO (C148.2 U3.L3), SD Card_WCN_RF (C180.2 U9.24)
VREG_L8_2P9: 21 MEMORY_POWER (7 pins), 17 PM8916_LDO (C156.2 U3.F1)
VREG_L9_3P3: 17 PM8916_LDO (C157.2 U3.C1), SD Card_WCN_RF (C182.2 R97.1 U9.11)
VREG_L11_SDC: 17 PM8916_LDO (C158.2 U3.G3), SD Card_WCN_RF (C120.2 C124.2 J5.4)
VREG_L12_SDC: 11 MSM8916_POWER2 (C5.2 U1.W8), 17 PM8916_LDO (C150.2 U3.B3), SD Card_WCN_RF (R45.2 U15.10)
VREG_L13_3P075: 12 MSM8916_POWER3 (C13.2 U1.AC32), 17 PM8916_LDO (C151.2 U3.D3)
VREG_S1_1P15: 11 MSM8916_POWER2 (25 pins), 12 MSM8916_POWER3 (U1.AF31 U1.U8), 16 PM8916_SMPS (L1.2), BYPASS_CAP (12 pins)
VREG_S2_1P15: 16 PM8916_SMPS (L2.2), BYPASS_CAP (13 pins)
VREG_S2_VSENSE: 16 PM8916_SMPS (U3.F7), BYPASS_CAP (JP2.1)
VREG_S3: 12 MSM8916_POWER3 (5 pins), 16 PM8916_SMPS (C76.2 C78.2 L3.2 U3.J8), 17 PM8916_LDO (U3.N1 U3.N2), SD Card_WCN_RF (20 pins)
VREG_S4: 16 PM8916_SMPS (C77.2 C79.2 L4.2 U3.K8), 17 PM8916_LDO (U3.M2 U3.M3 U3.N9 U3.P9)
WCSS_BT_DAT_CTL: 07_MSM8916_GPIO (U1.BA4), SD Card_WCN_RF (U9.18)
WCSS_BT_DAT_STB: 07_MSM8916_GPIO (U1.AW8), SD Card_WCN_RF (U9.28)
WCSS_BT_SSBI: 07_MSM8916_GPIO (U1.BC2), SD Card_WCN_RF (U9.33)
WCSS_FM_SDI: 07_MSM8916_GPIO (U1.AY9), SD Card_WCN_RF (U9.46)
WCSS_FM_SSBI: 07_MSM8916_GPIO (U1.AY5), SD Card_WCN_RF (U9.41)
WCSS_WLAN_CLK: 07_MSM8916_GPIO (U1.BB3), SD Card_WCN_RF (U9.61)
WCSS_WLAN_DATA_0: 07_MSM8916_GPIO (U1.BD3), SD Card_WCN_RF (U9.48)
WCSS_WLAN_DATA_1: 07_MSM8916_GPIO (U1.BB1), SD Card_WCN_RF (U9.26)
WCSS_WLAN_DATA_2: 07_MSM8916_GPIO (U1.BB5), SD Card_WCN_RF (U9.55)
WCSS_WLAN_SET: 07_MSM8916_GPIO (U1.BA6), SD Card_WCN_RF (U9.6)
WLAN_BB_I_M: 08_MSM8916_RF (U1.AR14), SD Card_WCN_RF (U9.59)
WLAN_BB_I_P: 08_MSM8916_RF (U1.AP15), SD Card_WCN_RF (U9.54)
WLAN_BB_Q_M: 08_MSM8916_RF (U1.AP13), SD Card_WCN_RF (U9.47)
WLAN_BB_Q_P: 08_MSM8916_RF (U1.AR12), SD Card_WCN_RF (U9.53)